# Altium schematic sheet FPGA_config.SchDoc: RNG RPI Interface
size 420 x 297 mm; Author: G.Kasprowicz; CompanyName: WUT ISE; DrawnBy: G.Kasprowicz; Organization: WUT ISE; Address1: PW ISE; Address2: Nowowiejska 15/19 00-665 Warsaw; Address3: gkasprow@gmail.com; Revision: 2; SheetNumber: -; SheetTotal: -; ModifiedBy: -; CheckedDate: -; Title2: FPGA config & RPI; DivGrp: WUT ISE; Designer: G.Kasprowicz; ModifiedDate: -; ProjectName: Sensor Box
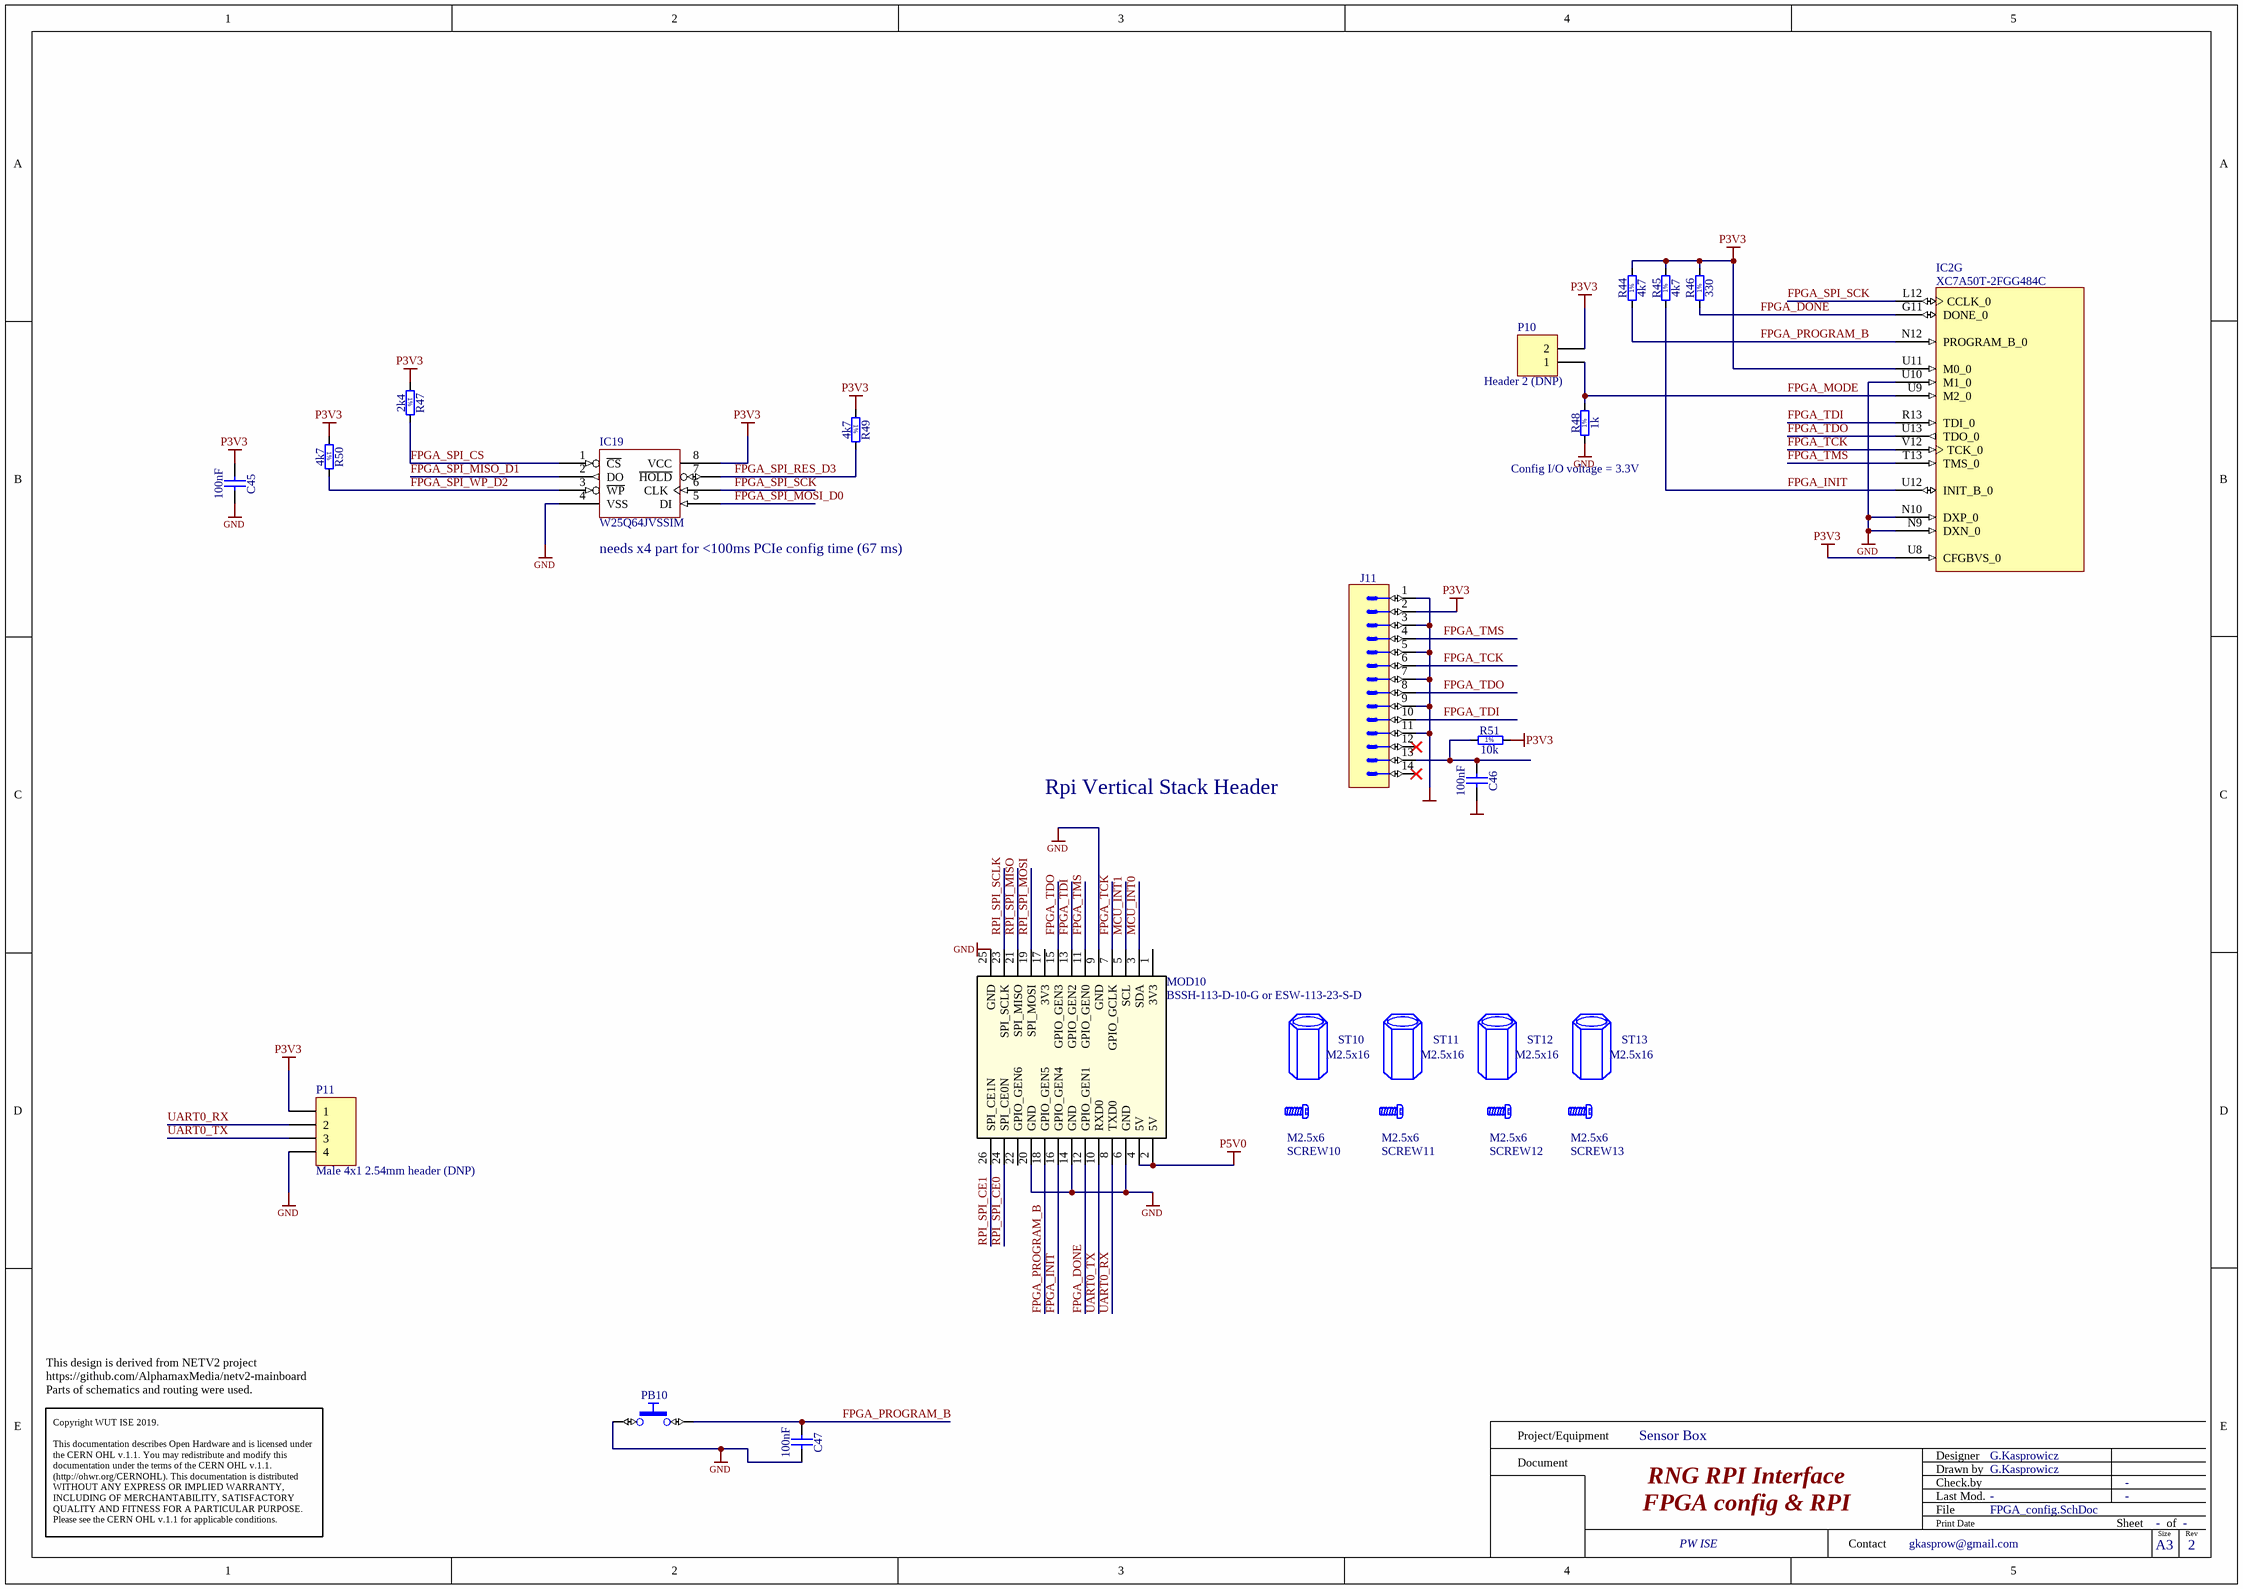
[diagram p0: FPGA_config.SchDoc]

## Parts
C45  100nF  [CAPC0603X33N]
C46  100nF  [CAPC0603X33N]
C47  100nF  [CAPC0603X33N]
IC2  XC7A50T-2FGG484C  [BGA484C100P22X22_2300X2300X260]  (part G of 11)
IC19  W25Q64JVSSIM  [SOIC127P790X216-8N]
J11  Milli-Grid™  [MOLEX_87832-1420]  (value not drawn)
MOD10  BSSH-113-D-10-G or ESW-113-23-S-D  [Raspberr Pi - 26]
P10  Header 2 (DNP)  [HDR1X2]
P11  Male 4x1 2.54mm header (DNP)  [HDR1X4]
PB10  Push Button  [PB_TYCO_FSMSM]  (value not drawn)
R44  4k7  [RESC1005X40N]
R45  4k7  [RESC1005X40N]
R46  330  [RESC1005X40N]
R47  2k4  [RESC1005X40N]
R48  1k  [RESC1005X40N]
R49  4k7  [RESC1005X40N]
R50  4k7  [RESC1005X40N]
R51  10k  [RESC1005X40N]
SCREW10  M2.5x6  [BOSSARD_BN5687-3061597_v]
SCREW11  M2.5x6  [BOSSARD_BN5687-3061597_v]
SCREW12  M2.5x6  [BOSSARD_BN5687-3061597_v]
SCREW13  M2.5x6  [BOSSARD_BN5687-3061597_v]
ST10  M2.5x16  [WURTH_970160155]
ST11  M2.5x16  [WURTH_970160155]
ST12  M2.5x16  [WURTH_970160155]
ST13  M2.5x16  [WURTH_970160155]

## Nets
GND: C45.2 C46.2 C47.2 IC2.N9(DXN_0) IC2.N10(DXP_0) IC2.U10(M1_0) IC19.4(VSS) J11.1 J11.3 J11.5 J11.7 J11.9 J11.11 MOD10.6(GND) MOD10.9(GND) MOD10.14(GND) MOD10.20(GND) MOD10.25(GND) P11.4 PB10.1 R48.1
P3V3: C45.1 IC2.U8(CFGBVS_0) IC2.U11(M0_0) IC19.8(VCC) J11.2 P10.2 P11.1 R44.2 R45.2 R46.2 R47.1 R49.1 R50.1 R51.2
P5V0: MOD10.2(5V) MOD10.4(5V)
FPGA_DONE: IC2.G11(DONE_0) MOD10.12(GPIO_GEN1) R46.1
FPGA_INIT: IC2.U12(INIT_B_0) MOD10.16(GPIO_GEN4) R45.1
FPGA_MODE: IC2.U9(M2_0) P10.1 R48.2
FPGA_PROGRAM_B: C47.1 IC2.N12(PROGRAM_B_0) MOD10.18(GPIO_GEN5) PB10.2 R44.1
FPGA_SPI_CS: IC19.1(~{CS}) R47.2
FPGA_SPI_MISO_D1: IC19.2(DO)
FPGA_SPI_MOSI_D0: IC19.5(DI)
FPGA_SPI_RES_D3: IC19.7(~{HOLD}) R49.2
FPGA_SPI_SCK: IC2.L12(CCLK_0) IC19.6(CLK)
FPGA_SPI_WP_D2: IC19.3(~{WP}) R50.2
FPGA_TCK: IC2.V12(TCK_0) J11.6 MOD10.7(GPIO_GCLK)
FPGA_TDI: IC2.R13(TDI_0) J11.10 MOD10.13(GPIO_GEN2)
FPGA_TDO: IC2.U13(TDO_0) J11.8 MOD10.15(GPIO_GEN3)
FPGA_TMS: IC2.T13(TMS_0) J11.4 MOD10.11(GPIO_GEN0)
MCU_INT0: MOD10.3(SDA)
MCU_INT1: MOD10.5(SCL)
RPI_SPI_CE0: MOD10.24(SPI_CE0N)
RPI_SPI_CE1: MOD10.26(SPI_CE1N)
RPI_SPI_MISO: MOD10.21(SPI_MISO)
RPI_SPI_MOSI: MOD10.19(SPI_MOSI)
RPI_SPI_SCLK: MOD10.23(SPI_SCLK)
UART0_RX: MOD10.8(TXD0) P11.2
UART0_TX: MOD10.10(RXD0) P11.3
NetC46_1: C46.1 J11.13 R51.1

Not connected (* = marked no-connect by the designer): J11 12* 14*; MOD10 1(3V3) 17(3V3) 22(GPIO_GEN6)

## Notes on the sheet
- (near R48) Config I/O voltage = 3.3V
- (near IC19) needs x4 part for <100ms PCIe config time (67 ms)
- Rpi Vertical Stack Header
- This design is derived from NETV2 project
  https://github.com/AlphamaxMedia/netv2-mainboard
  Parts of schematics and routing were used.
- Project/Equipment
- Document
- Designer
- Drawn by
- Check.by
- Copyright WUT ISE 2019.
  This documentation describes Open Hardware and is licensed under the CERN OHL v.1.1. You may redistribute and modify this documentation under the terms of the CERN OHL v.1.1. (http://ohwr.org/CERNOHL). This documentation is distributed WITHOUT ANY EXPRESS OR IMPLIED WARRANTY, INCLUDING OF MERCHANTABILITY, SATISFACTORY QUALITY AND FITNESS FOR A PARTICULAR PURPOSE. Please see the CERN OHL v.1.1 for applicable conditions.
- Contact
- File
- Last Mod.
- Print Date
- Sheet
- Size
- A3
- of
- Rev
- (in symbol R0402_1K_1%_0.0625W_100PPM) 1%
- (in symbol R0402_2K4_1%_0.0625W_100PPM) 1%
- (in symbol R0402_4K7_1%_0.0625W_100PPM) 1%
- (in symbol R0402_10K_1%_0.0625W_100PPM) 1%
- (in symbol R0402_330R_1%_0.0625W_100PPM) 1%

## Library data of the parts
C45-C47 = CC0201_100NF_6.3V_10%_X5R: Non-polarised capacitor; Part Description: SMD Multilayer Chip Ceramic Capacitor; Manufacturer: GENERIC; Manufacturer1 Part Number: 02016D104KAT2A; Voltage: 6.3V; TC: X5R; Tolerance: ±10%; Part Number: CC0201_100NF_6.3V_10%_X5R; Component Kind: Standard; Component Type: Standard; Pin Count: 2; Value: 100nF; Status: Not Recommended; Manufacturer Part Number: CC0201_100NF_6.3V_10%_X5R; Case: 0201; Mounted: Yes; Socket: No; SMD: Yes; Sense: No; Manufacturer1 Example: AVX; Manufacturer1 ComponentHeight: 0.33mm; HelpURL: \\cern.ch\dfs\Applications\Altium\Datasheets\CC0201_X5R_AVX.pdf; Author: CERN DEM JLC; CreateDate: 03.12.2007; LatestRevisionDate: 03.12.2007
IC2 = XC7A50T-2FGG484C: Artix-7 FPGA, 4 GTPs, 250 User I/Os, 484-Ball Fine-Pitch Thin BGA (1.0mm Pitch), Speed Grade 2, Commercial Grade, Pb-Free; Manufacturer: XILINX; PressFit: No; Bonding: No; Part Number: XC7A50T-2FGG484C; Component Kind: Standard; Component Type: Standard; Device: XC7A50T-2FGG484C; PackageDescription: BGA, 1.00mm Pitch, Square; 484 Pin, 22 Columns x 22 Rows, Body 23mm X 23mm X 2.60mm H, IPC Medium Density; Part Description: Artix-7 FPGA, 4 GTPs, 250 User I/Os, 484-Ball Fine-Pitch Thin BGA (1.0mm Pitch), Speed Grade 2, Commercial Grade, Pb-Free; Manufacturer Part Number: XC7A50T-2FGG484C; Pin Count: 484; Case: BGA484; Mounted: Yes; Socket: No; SMD: Yes; Sense: No; ComponentHeight: 2.6mm; HelpURL: \\cern.ch\dfs\Applications\Altium\Datasheets\XC7A50T-2FGG484C.pdf; ComponentLink1URL: \\cern.ch\dfs\Applications\Altium\Datasheets\XC7A50T-2FGG484C_Package-Pinout.pdf; ComponentLink1Description: Package/Pinout; Author: CERN DEM JMW; CreateDate: 26.07.2018; LatestRevisionDate: 26.07.2018
IC19 = EN25P05-50GCP: 64Mbit SPI NOR FLASH; MYPN: UW25Q64JVSSIM; VENDOR: Winbond; MPN: W25Q64JVSSIM
J11 = MOLEX_87832-1420: Connector 14 Male; Part Description: 2.00mm (.079") Pitch Milli-Grid™ Header, Surface Mount, Vertical, Shrouded, 14 Circuits,with Locking Windows and Centre Polarization Slot, PCB Locator; Manufacturer: MOLEX; PressFit: No; Part Number: MOLEX_87832-1420; Component Kind: Standard; Component Type: Standard; Pin Count: 14; Family: Milli-Grid™; Mounted: Yes; Socket: No; SMD: Yes; Sense: No; Status: None; Manufacturer Part Number: 87832-1420; ComponentHeight: 7.6mm; HelpURL: \\cern.ch\dfs\Applications\Altium\Datasheets\MOLEX_87832-1420.pdf; Author: CERN DEM JLC; CreateDate: 09.09.2008; LatestRevisionDate: 09.09.2008
MOD10 = Raspberry Pi - 26: Manufacturer: Major League Electroncis; Datasheet: http://s3.amazonaws.com/mlkelly/productMedia/BSSH-1/BSSH-1-D-Datasheet.pdf; Price1: 1.95; Value: BSSH-113-D-10-G or ESW-113-23-S-D; Supplier 1: https://www.adafruit.com/product/1112; Supplier Part Number 1: BSSH-113-D-10-G or ESW-113-23-S-D; Manufacturer Part Number: BSSH-113-D-10-G or ESW-113-23-S-D
P10 = Header 2: Header, 2-Pin; LatestRevisionDate: 17-Jul-2002; LatestRevisionNote: Re-released for DXP Platform.; Publisher: Altium Limited; VENDOR: DNP; MPN: DNP; MYPN: DNP
P11 = Header 4: Header, 4-Pin; MYPN: J-HDR-2.54-4x1-STD-DNP; LatestRevisionDate: 17-Jul-2002; LatestRevisionNote: Re-released for DXP Platform.; Publisher: Altium Limited; MPN: DNP; VENDOR: DNP
PB10 = PB_TYCO_FSMSM: Push-Button Switch SPDT; Part Description: 12VDC 50mA SPST Tactile  Push-Button Switch; Manufacturer: TYCO ELECTRONICS; Manufacturer Part Number: FSMSM or 1437566-3; PressFit: No; Part Number: PB_TYCO_FSMSM; Component Kind: Standard; Component Type: Standard; Pin Count: 2; PackageDescription: Body 3.5x6.0mm, Pushbutton Switch,  TYCO ALCOSWITCH FSMSM Serie; Family: Push Button; Mounted: Yes; Socket: No; SMD: Yes; Sense: No; Status: None; ComponentHeight: 4.3mm; HelpURL: \\cern.ch\dfs\Applications\Altium\Datasheets\PB_TYCO_FSMSM.pdf; Author: CERN DEM JLC; CreateDate: 30.06.2008; LatestRevisionDate: 21.06.2012
R44 R45 R49 R50 = R0402_4K7_1%_0.0625W_100PPM: Resistor - 1%; Part Description: General Purpose Thick Film Chip Resistor; Manufacturer: GENERIC; Manufacturer1 Part Number: 232270674702L; TC: ±100ppm/°C; PressFit: No; Part Number: R0402_4K7_1%_0.0625W_100PPM; Component Kind: Standard; Component Type: Standard; Pin Count: 2; Value: 4k7; Status: Not Recommended; Power: 0.0625W; Tolerance: ±1%; Manufacturer Part Number: R0402_4K7_1%_0.0625W_100PPM; Case: 0402; Mounted: Yes; Sense: No; Socket: No; SMD: Yes; Manufacturer1 Example: YAGEO PHYCOMP; Manufacturer1 ComponentHeight: 0.4mm; HelpURL: \\cern.ch\dfs\Applications\Altium\Datasheets\R0402_Phycomp_RC0402.pdf; Author: CERN DEM JLC; CreateDate: 03.12.2007; LatestRevisionDate: 17.10.2012
R46 = R0402_330R_1%_0.0625W_100PPM: Resistor - 1%; Part Description: General Purpose Thick Film Chip Resistor; Manufacturer: GENERIC; Manufacturer1 Part Number: 232270673301L; TC: ±100ppm/°C; PressFit: No; Part Number: R0402_330R_1%_0.0625W_100PPM; Component Kind: Standard; Component Type: Standard; Pin Count: 2; Value: 330; Status: Not Recommended; Power: 0.0625W; Tolerance: ±1%; Manufacturer Part Number: R0402_330R_1%_0.0625W_100PPM; Case: 0402; Mounted: Yes; Sense: No; Socket: No; SMD: Yes; Manufacturer1 Example: YAGEO PHYCOMP; Manufacturer1 ComponentHeight: 0.4mm; HelpURL: \\cern.ch\dfs\Applications\Altium\Datasheets\R0402_Phycomp_RC0402.pdf; Author: CERN DEM JLC; CreateDate: 03.12.2007; LatestRevisionDate: 17.10.2012
R47 = R0402_2K4_1%_0.0625W_100PPM: Resistor - 1%; Part Description: General Purpose Thick Film Chip Resistor; Manufacturer: GENERIC; Manufacturer1 Part Number: 232270672402L; TC: ±100ppm/°C; PressFit: No; Part Number: R0402_2K4_1%_0.0625W_100PPM; Component Kind: Standard; Component Type: Standard; Pin Count: 2; Value: 2k4; Status: Not Recommended; Power: 0.0625W; Tolerance: ±1%; Manufacturer Part Number: R0402_2K4_1%_0.0625W_100PPM; Case: 0402; Mounted: Yes; Sense: No; Socket: No; SMD: Yes; Manufacturer1 Example: YAGEO PHYCOMP; Manufacturer1 ComponentHeight: 0.4mm; HelpURL: \\cern.ch\dfs\Applications\Altium\Datasheets\R0402_Phycomp_RC0402.pdf; Author: CERN DEM JLC; CreateDate: 03.12.2007; LatestRevisionDate: 17.10.2012
R48 = R0402_1K_1%_0.0625W_100PPM: Resistor - 1%; Part Description: General Purpose Thick Film Chip Resistor; Manufacturer: GENERIC; Manufacturer1 Part Number: 232270671002L; TC: ±100ppm/°C; PressFit: No; Part Number: R0402_1K_1%_0.0625W_100PPM; Component Kind: Standard; Component Type: Standard; Pin Count: 2; Value: 1k; Status: Not Recommended; Power: 0.0625W; Tolerance: ±1%; Manufacturer Part Number: R0402_1K_1%_0.0625W_100PPM; Case: 0402; Mounted: Yes; Sense: No; Socket: No; SMD: Yes; Manufacturer1 Example: YAGEO PHYCOMP; Manufacturer1 ComponentHeight: 0.4mm; HelpURL: \\cern.ch\dfs\Applications\Altium\Datasheets\R0402_Phycomp_RC0402.pdf; Author: CERN DEM JLC; CreateDate: 03.12.2007; LatestRevisionDate: 17.10.2012
R51 = R0402_10K_1%_0.0625W_100PPM: Resistor - 1%; Part Description: General Purpose Thick Film Chip Resistor; Manufacturer: GENERIC; Manufacturer1 Part Number: 232270671003L; TC: ±100ppm/°C; PressFit: No; Part Number: R0402_10K_1%_0.0625W_100PPM; Component Kind: Standard; Component Type: Standard; Pin Count: 2; Value: 10k; Status: Not Recommended; Power: 0.0625W; Tolerance: ±1%; Manufacturer Part Number: R0402_10K_1%_0.0625W_100PPM; Case: 0402; Mounted: Yes; Sense: No; Socket: No; SMD: Yes; Manufacturer1 Example: YAGEO PHYCOMP; Manufacturer1 ComponentHeight: 0.4mm; HelpURL: \\cern.ch\dfs\Applications\Altium\Datasheets\R0402_Phycomp_RC0402.pdf; Author: CERN DEM JLC; CreateDate: 03.12.2007; LatestRevisionDate: 17.10.2012; ClassName: FPGA_JTAG
SCREW10-SCREW13 = BOSSARD_BN5687-3061597_v: Screw; Part Description: M2.5 L=6mm Hexalobular Socket Pan Head Screw, Fully Threaded, Stainless Steel A2; Manufacturer Part Number: BN5687 Art.3061597; PressFit: No; Part Number: BOSSARD_BN5687-3061597_v; Component Kind: Standard; Component Type: Mechanical; Pin Count: 0; PackageDescription: M2.5 L=6mm Hexalobular Socket Pan Head Screw, Fully Threaded - Stainless Steel A2; Mounted: Yes; Socket: No; SMD: No; Sense: No; Status: None; Value: M2.5x6; Manufacturer: BOSSARD; ComponentHeight: 2.1mm; HelpURL: \\cern.ch\dfs\Applications\Altium\Datasheets\BOSSARD_BN5687-3061597.pdf; Author: CERN DEM JLC; CreateDate: 30.05.2013; LatestRevisionDate: 30.05.2013
ST10-ST13 = MECH_Standoff_M2.5x16: M2.5x16 plastic standoff; Part Description: M2.5x16 female Hex Spacer made of plastic; Manufacturer: WURTH; Manufacturer Part Number: 970160155; PressFit: No; Part Number: WURTH_970160155; Component Kind: Standard; Component Type: Mechanical; Pin Count: 0; PackageDescription: M2.5 L=16mm Hexalobular Socket Pan Head Screw, Fully Threaded - plastic; Mounted: Yes; Socket: No; SMD: No; Sense: No; Status: None; Value: M2.5x16; ComponentHeight: 16mm; HelpURL: \\cern.ch\dfs\Applications\Altium\Datasheets\BOSSARD_BN5687-3061597.pdf; Author: GK; CreateDate: 25.02.2019; LatestRevisionDate: 25.02.2019